# Altium schematic sheet Sheet_1_2023-02-27.schdoc
size 163 x 87 mm
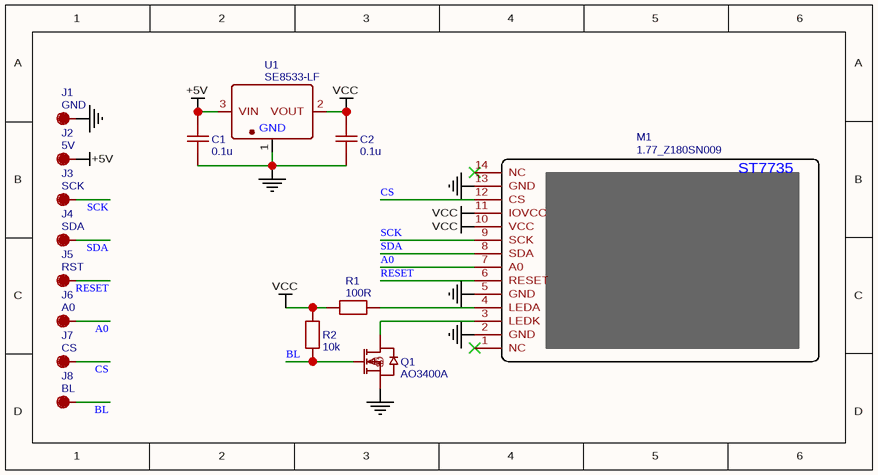
[diagram p0: Sheet_1_2023-02-27.schdoc]

## Parts
C1  0.1u  [C0402]
C2  0.1u  [C0402]
J1  GND  [PIN-1S]
J2  5V  [PIN-1S]
J3  SCK  [PIN-1S]
J4  SDA  [PIN-1S]
J5  RST  [PIN-1S]
J6  A0  [PIN-1S]
J7  CS  [PIN-1S]
J8  BL  [PIN-1S]
M1  1.77_Z180SN009  [1.77_Z180SN009]
Q1  AO3400A  [SOT-23-3_L2.9-W1.3-P1.90-LS2.4-BR]
R1  100R  [R0402]
R2  10k  [R0402]
U1  SE8533-LF  [SOT-23-3_L2.9-W1.3-P1.90-LS2.4-BR]

## Nets
+5V: C1.2 J2.1(TEST) U1.3(VIN)
GND: C1.1 C2.1 J1.1(TEST) M1.2(GND) M1.5(GND) M1.13(GND) Q1.2(S) U1.1(GND)
VCC: C2.2 M1.10(VCC) M1.11(IOVCC) R1.1 R2.2 U1.2(VOUT)
A0: J6.1(TEST) M1.7(A0)
BL: J8.1(TEST) Q1.1(G) R2.1
CS: J7.1(TEST) M1.12(CS)
RESET: J5.1(TEST) M1.6(RESET)
SCK: J3.1(TEST) M1.9(SCK)
SDA: J4.1(TEST) M1.8(SDA)
NetM1_3: M1.3(LEDK) Q1.3(D)
NetM1_4: M1.4(LEDA) R1.2

Not connected (* = marked no-connect by the designer): M1 1(NC)* 14(NC)*

## Notes on the sheet
- (in symbol 1.77_Z180SN009) ST7735

## Library data of the parts
C1 C2 = 0.1u: nameAlias: Value(F); Contributor: LCEDA_Lib; spicePre: C; spiceSymbolName: C_0402_US
J1 = GND: Contributor: 私有工程; spicePre: J; spiceSymbolName: PIN-1S
J2 = 5V: Contributor: 私有工程; spicePre: J; spiceSymbolName: PIN-1S
J3 = SCK: Contributor: 私有工程; spicePre: J; spiceSymbolName: PIN-1S
J4 = SDA: Contributor: 私有工程; spicePre: J; spiceSymbolName: PIN-1S
J5 = RST: Contributor: 私有工程; spicePre: J; spiceSymbolName: PIN-1S
J6 = A0: Contributor: 私有工程; spicePre: J; spiceSymbolName: PIN-1S
J7 = CS: Contributor: 私有工程; spicePre: J; spiceSymbolName: PIN-1S
J8 = BL: Contributor: 私有工程; spicePre: J; spiceSymbolName: PIN-1S
M1 = 1.77_Z180SN009: Contributor: 私有工程; spicePre: M; spiceSymbolName: 1.77_Z180SN009
Q1 = AO3400A: BOM_Manufacturer: AOS; SMT Type: Basic; Contributor: 私有工程; BOM_Supplier: LCSC; BOM_Manufacturer Part: AO3400A; BOM_LCSC Assembly: Yes; image: //image.lceda.cn/szlcsc/C20917.jpg; BOM_Supplier Part: C20917; spicePre: Q; spiceSymbolName: AO3400A
R1 = 100R: nameAlias: Value(Ω); Contributor: LCEDA_Lib; spicePre: R; spiceSymbolName: R_0402_EU
R2 = 10k: nameAlias: Value(Ω); Contributor: LCEDA_Lib; spicePre: R; spiceSymbolName: R_0402_EU
U1 = SE8533-LF: BOM_Manufacturer: SEAWARD; SMT Type: Extend; Contributor: 私有工程; BOM_Supplier: LCSC; BOM_Manufacturer Part: SE8533-LF; BOM_Supplier Part: C115016; BOM_JLCPCB SMD: Yes; spicePre: U; spiceSymbolName: SE8533-LF